# Altium schematic sheet 01_Power-Core.SchDoc
size A4
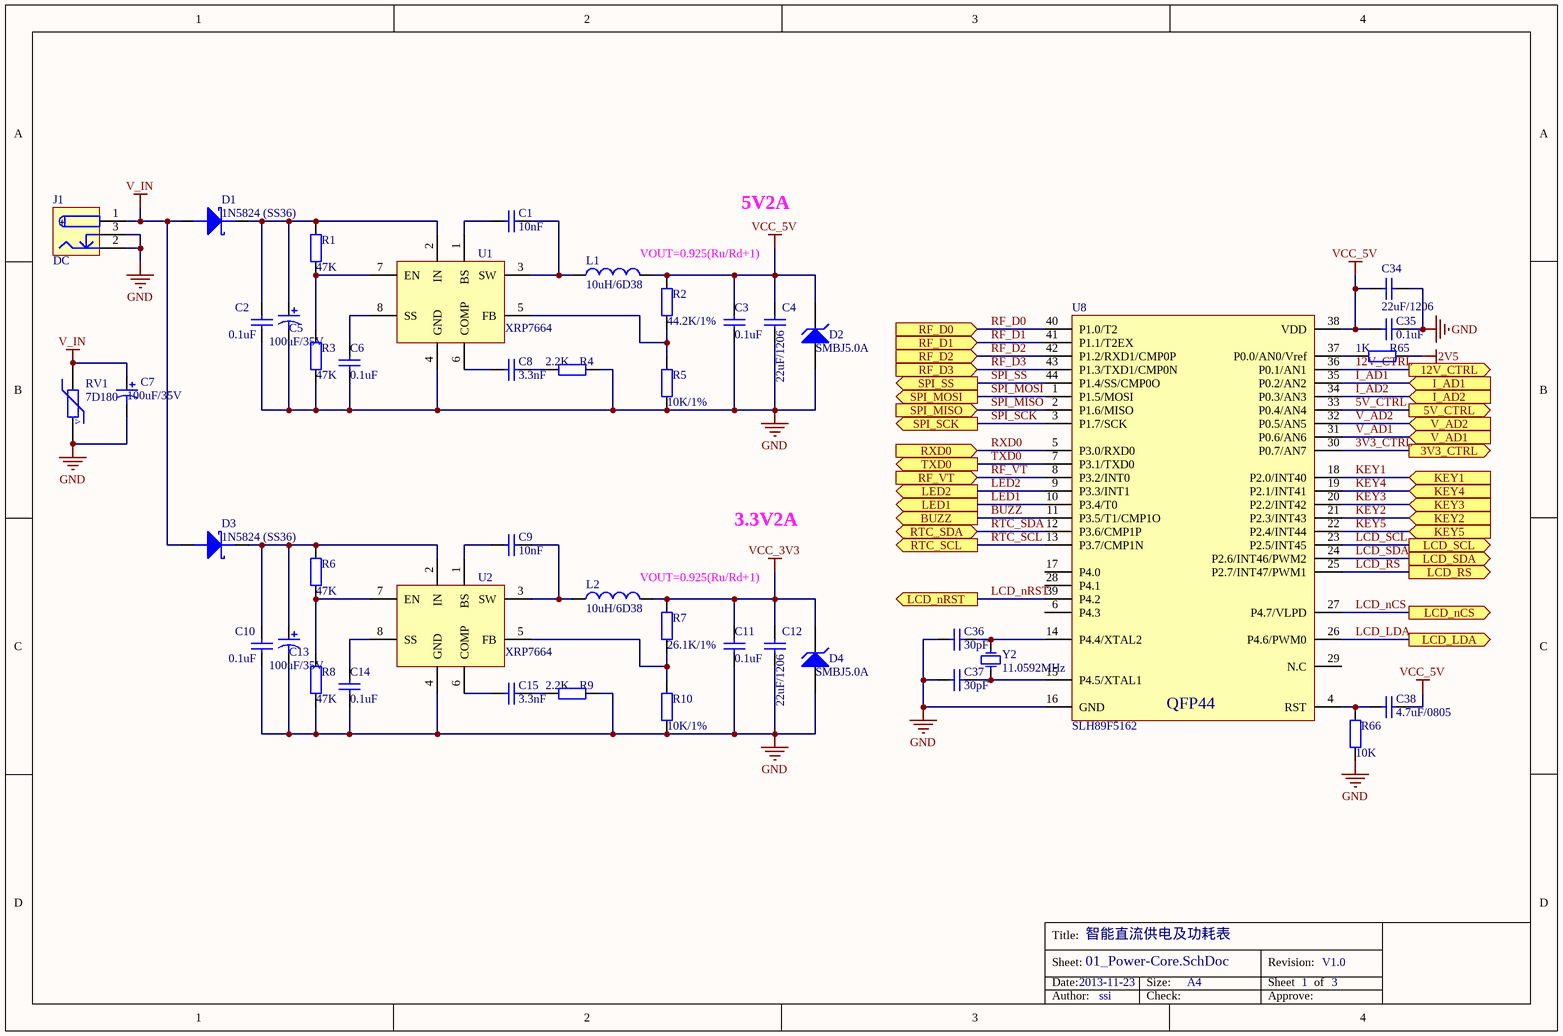
[diagram p0: 01_Power-Core.SchDoc]

## Parts
C1  10nF  [0603C]
C2  0.1uF  [0603C]
C3  0.1uF  [0603C]
C4  22uF/1206  [1206]
C5  100uF/35V  [CAP_6.3X11]
C6  0.1uF  [0603C]
C7  100uF/35V  [CAP_6.3X11]
C8  3.3nF  [0603C]
C9  10nF  [0603C]
C10  0.1uF  [0603C]
C11  0.1uF  [0603C]
C12  22uF/1206  [1206]
C13  100uF/35V  [CAP_6.3X11]
C14  0.1uF  [0603C]
C15  3.3nF  [0603C]
C34  22uF/1206  [1206]
C35  0.1uF  [0603C]
C36  30pF  [0603C]
C37  30pF  [0603C]
C38  4.7uF/0805  [0805]
D1  1N5824 (SS36)  [SMA/DO-214AC]
D2  SMBJ5.0A  [SMB/DO-214AB]
D3  1N5824 (SS36)  [SMA/DO-214AC]
D4  SMBJ5.0A  [SMB/DO-214AB]
J1  DC  [DC5.0mm]
L1  10uH/6D38  [INDUCTOR-6D38]
L2  10uH/6D38  [INDUCTOR-6D38]
R1  47K  [0603]
R2  44.2K/1%  [0603]
R3  47K  [0603]
R4  2.2K  [0603]
R5  10K/1%  [0603]
R6  47K  [0603]
R7  26.1K/1%  [0603]
R8  47K  [0603]
R9  2.2K  [0603]
R10  10K/1%  [0603]
R65  1K  [0603]
R66  10K  [0603]
RV1  7D180  [RV2_7D]
U1  XRP7664  [SOIC-8]
U2  XRP7664  [SOIC-8]
U8  SLH89F5162  [LQFP44]
Y2  11.0592MHz  [XTAL]

## Ports
3V3_CTRL (out), 5V_CTRL (out), 12V_CTRL (out), BUZZ (out), I_AD1 (in), I_AD2 (in), KEY1 (in), KEY2 (in), KEY3 (in), KEY4 (in), KEY5 (in), LCD_LDA (out), LCD_nCS (out), LCD_nRST (out), LCD_RS (out), LCD_SCL (out), LCD_SDA (out), LED1 (out), LED2 (out), RF_D0 (in), RF_D1 (in), RF_D2 (in), RF_D3 (in), RF_VT (in), RTC_SCL (out), RTC_SDA (bidir), RXD0 (in), SPI_MISO (in), SPI_MOSI (out), SPI_SCK (out), SPI_SS (out), TXD0 (out), V_AD1 (in), V_AD2 (in)

## Nets
2V5: R65.2
GND: C2.1 C3.1 C4.1 C5.2 C6.1 C7.2 C10.1 C11.1 C12.1 C13.2 C14.1 C34.1 C35.2 C36.1 C37.1 D2.1(A) D4.1(A) J1.2(-) J1.3(W) R3.1 R4.2 R5.1 R8.1 R9.2 R10.1 R66.1 RV1.1 U1.4(GND) U2.4(GND) U8.16(GND)
V_IN: C7.1 D1.1(A) D3.1(A) J1.1(+) RV1.2
VCC_3V3: C11.2 C12.2 D4.2(K) L2.2 R7.2
VCC_5V: C3.2 C4.2 C34.2 C35.1 C38.1 D2.2(K) L1.2 R2.2 U8.38(VDD)
3V3_CTRL: U8.30(P0.7/AN7) ; port 3V3_CTRL
5V_CTRL: U8.33(P0.4/AN4) ; port 5V_CTRL
12V_CTRL: U8.36(P0.1/AN1) ; port 12V_CTRL
BUZZ: U8.11(P3.5/T1/CMP1O) ; port BUZZ
I_AD1: U8.35(P0.2/AN2) ; port I_AD1
I_AD2: U8.34(P0.3/AN3) ; port I_AD2
KEY1: U8.18(P2.0/INT40) ; port KEY1
KEY2: U8.21(P2.3/INT43) ; port KEY2
KEY3: U8.20(P2.2/INT42) ; port KEY3
KEY4: U8.19(P2.1/INT41) ; port KEY4
KEY5: U8.22(P2.4/INT44) ; port KEY5
LCD_LDA: U8.26(P4.6/PWM0) ; port LCD_LDA
LCD_nCS: U8.27(P4.7/VLPD) ; port LCD_nCS
LCD_nRST: U8.39(P4.2) ; port LCD_nRST
LCD_RS: U8.25(P2.7/INT47/PWM1) ; port LCD_RS
LCD_SCL: U8.23(P2.5/INT45) ; port LCD_SCL
LCD_SDA: U8.24(P2.6/INT46/PWM2) ; port LCD_SDA
LED1: U8.10(P3.4/T0) ; port LED1
LED2: U8.9(P3.3/INT1) ; port LED2
RF_D0: U8.40(P1.0/T2) ; port RF_D0
RF_D1: U8.41(P1.1/T2EX) ; port RF_D1
RF_D2: U8.42(P1.2/RXD1/CMP0P) ; port RF_D2
RF_D3: U8.43(P1.3/TXD1/CMP0N) ; port RF_D3
RF_VT: U8.8(P3.2/INT0) ; port RF_VT
RTC_SCL: U8.13(P3.7/CMP1N) ; port RTC_SCL
RTC_SDA: U8.12(P3.6/CMP1P) ; port RTC_SDA
RXD0: U8.5(P3.0/RXD0) ; port RXD0
SPI_MISO: U8.2(P1.6/MISO) ; port SPI_MISO
SPI_MOSI: U8.1(P1.5/MOSI) ; port SPI_MOSI
SPI_SCK: U8.3(P1.7/SCK) ; port SPI_SCK
SPI_SS: U8.44(P1.4/SS/CMP0O) ; port SPI_SS
TXD0: U8.7(P3.1/TXD0) ; port TXD0
V_AD1: U8.31(P0.6/AN6) ; port V_AD1
V_AD2: U8.32(P0.5/AN5) ; port V_AD2
NetC1_1: C1.1 U1.1(BS)
NetC1_2: C1.2 L1.1 U1.3(SW)
NetC2_2: C2.2 C5.1 D1.2(K) R1.2 U1.2(IN)
NetC6_2: C6.2 U1.8(SS)
NetC8_1: C8.1 U1.6(COMP)
NetC8_2: C8.2 R4.1
NetC9_1: C9.1 U2.1(BS)
NetC9_2: C9.2 L2.1 U2.3(SW)
NetC10_2: C10.2 C13.1 D3.2(K) R6.2 U2.2(IN)
NetC14_2: C14.2 U2.8(SS)
NetC15_1: C15.1 U2.6(COMP)
NetC15_2: C15.2 R9.1
NetC36_2: C36.2 U8.14(P4.4/XTAL2) Y2.2(OSC2)
NetC37_2: C37.2 U8.15(P4.5/XTAL1) Y2.1(OSC1)
NetC38_2: C38.2 R66.2 U8.4(RST)
NetR1_1: R1.1 R3.2 U1.7(EN)
NetR2_1: R2.1 R5.2 U1.5(FB)
NetR6_1: R6.1 R8.2 U2.7(EN)
NetR7_1: R7.1 R10.2 U2.5(FB)
NetR65_1: R65.1 U8.37(P0.0/AN0/Vref)

Not connected (* = marked no-connect by the designer): U8 6(P4.3) 17(P4.0) 28(P4.1) 29(N.C)

## Notes on the sheet
- 5V2A
- (near L1) VOUT=0.925(Ru/Rd+1)
- (near L2) VOUT=0.925(Ru/Rd+1)
- 3.3V2A
- 2013-11-23
- 智能直流供电及功耗表
- 1        3
- V1.0
- ssi
- Title:
- Sheet:
- Date:
- Size:
- A4
- Revision:
- Sheet
- of
- Author:
- Check:
- Approve:
- (in symbol RES VDR) V
- (in symbol SLH89F5162_QFP44) QFP44

## Library data of the parts
C1-C4 C6 C8-C12 C14 C15 C34-C38 = Cap: Capacitor; Published: 8-Jun-2000; LatestRevisionDate: 17-Jul-2002; LatestRevisionNote: Re-released for DXP Platform.; PackageReference: RAD-0.3; Publisher: Altium Limited
C5 C7 C13 = Cap2: Capacitor; Published: 23-Sep-2002; PackageReference: CAPR5-4X5; Publisher: Altium Limited
D1 D3 = DIODE_1N582x: Schottky Diode
D2 D4 = DIODE_SMBJxx: Zener Diode; Published: 8-Jun-2000; LatestRevisionDate: 17-Jul-2002; LatestRevisionNote: Re-released for DXP Platform.; PackageReference: DIODE-0.7; Publisher: Altium Limited
J1 = DC_PWR: Low Voltage Power Supply Connector; Published: 17-Dec-2003; DatasheetDocument: 09-May-2002; Publisher: Altium Limited
L1 L2 = Inductor: Code_IEC: 1005; Published: 8-Jun-2000; LatestRevisionDate: 17-Jul-2002; LatestRevisionNote: Re-released for DXP Platform.; PackageReference: 0402-A; Publisher: Altium Limited; Code_JEITA: 0402; Value: Inductor
R1-R10 R65 R66 = Res2: Resistor; Published: 8-Jun-2000; LatestRevisionDate: 17-Jul-2002; LatestRevisionNote: Re-released for DXP Platform.; PackageReference: AXIAL-0.4; Publisher: Altium Limited
RV1 = RES VDR: Varistor (Voltage-Sensitive Resistor) 压敏电阻; Published: 24-Mar-1999; LatestRevisionDate: 04-Mar-2005; LatestRevisionNote: PCB Footprint replaced.; PackageReference: 6-0805; Publisher: Altium Limited
U1 U2 = XRP7664/MP1482: 2A  18V  Synchronous  Step-Down Converter
U8 = SLH89F5162_QFP44
Y2 = XTAL: Crystal Oscillator; Published: 8-Jun-2000; LatestRevisionDate: 17-Jul-2002; LatestRevisionNote: Re-released for DXP Platform.; PackageReference: R38; Publisher: Altium Limited